# EAGLE design MAPE-CUN-Large-016 (EAGLE 7.3.0)
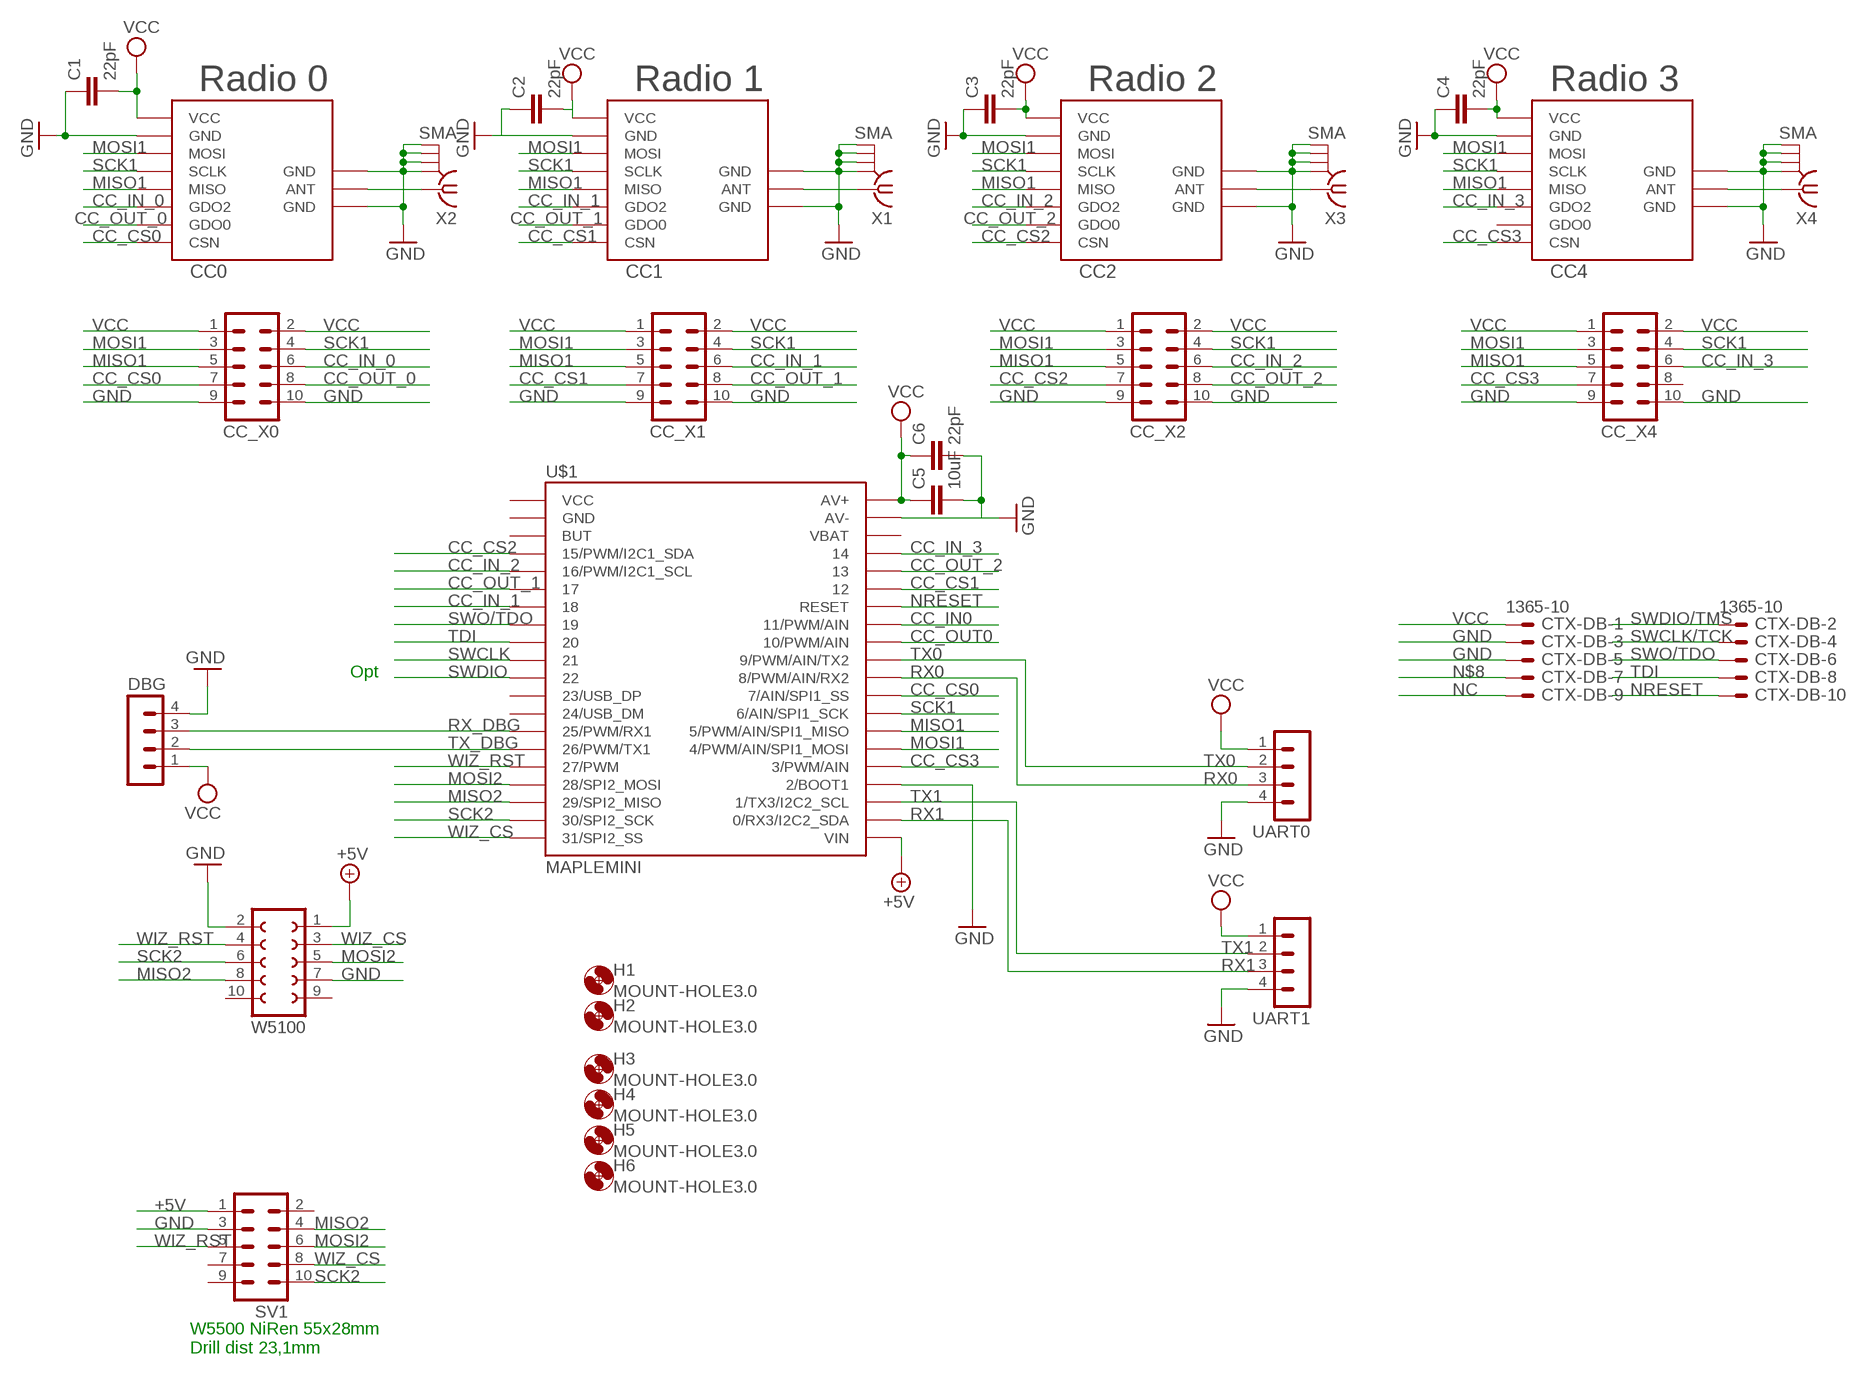
[diagram p0: schematic, sheet 1]

## Parts
C1  22pF  C-EUC0805  [C0805]
C2  22pF  C-EUC0805  [C0805]
C3  22pF  C-EUC0805  [C0805]
C4  22pF  C-EUC0805  [C0805]
C5  10uF  C-EUC1210  [C1210]
C6  22pF  C-EUC0805  [C0805]
CC0  CC1101_MODULE1SMD  [CC1101_MODULE1_SMD]
CC1  CC1101_MODULE1SMD  [CC1101_MODULE1_SMD]
CC2  CC1101_MODULE1SMD  [CC1101_MODULE1_SMD]
CC4  CC1101_MODULE1SMD  [CC1101_MODULE1_SMD]
CC_X0  MA05-2  [MA05-2]
CC_X1  MA05-2  [MA05-2]
CC_X2  MA05-2  [MA05-2]
CC_X4  MA05-2  [MA05-2]
CTX-DB  1365-10  [1365-10]
DBG  MA04-1  [MA04-1]
H1  MOUNT-HOLE3.0  [3,0]
H2  MOUNT-HOLE3.0  [3,0]
H3  MOUNT-HOLE3.0  [3,0]
H4  MOUNT-HOLE3.0  [3,0]
H5  MOUNT-HOLE3.0  [3,0]
H6  MOUNT-HOLE3.0  [3,0]
SV1  MA05-2  [MA05-2]
U$1  MAPLEMINI  [20-DIP]
UART0  MA04-1  [MA04-1]
UART1  MA04-1  [MA04-1]
W5100  FE05-2  [FE05-2]
X1  SMA  [SMA]
X2  SMA  [SMA]
X3  SMA  [SMA]
X4  SMA  [SMA]

## Nets
+5V: SV1.1 U$1.21(VIN) W5100.1
CC_CS0: CC0.CSN CC_X0.7 U$1.29(7/AIN/SPI1_SS)
CC_CS1: CC1.CSN CC_X1.7 U$1.35
CC_CS2: CC2.CSN CC_X2.7 U$1.4(15/PWM/I2C1_SDA)
CC_CS3: CC4.CSN CC_X4.7 U$1.25(3/PWM/AIN)
CC_IN0: U$1.33(11/PWM/AIN)
CC_IN_0: CC0.GDO2 CC_X0.6
CC_IN_1: CC1.GDO2 CC_X1.6 U$1.7
CC_IN_2: CC2.GDO2 CC_X2.6 U$1.5(16/PWM/I2C1_SCL)
CC_IN_3: CC4.GDO2 CC_X4.6 U$1.37
CC_OUT0: U$1.32(10/PWM/AIN)
CC_OUT_0: CC0.GDO0 CC_X0.8
CC_OUT_1: CC1.GDO0 CC_X1.8 U$1.6
CC_OUT_2: CC2.GDO0 CC_X2.8 U$1.36
GND: C1.1 C2.1 C3.1 C4.1 C5.2 C6.2 CC0.GND@0(GND) CC0.GND@1(GND) CC0.GND@2(GND) CC1.GND@0(GND) CC1.GND@1(GND) CC1.GND@2(GND) CC2.GND@0(GND) CC2.GND@1(GND) CC2.GND@2(GND) CC4.GND@0(GND) CC4.GND@1(GND) CC4.GND@2(GND) CC_X0.9 CC_X0.10 CC_X1.9 CC_X1.10 CC_X2.9 CC_X2.10 CC_X4.9 CC_X4.10 CTX-DB.3 CTX-DB.5 DBG.4 SV1.3 U$1.24(2/BOOT1) U$1.39(AV-) UART0.4 UART1.4 W5100.2 W5100.7 X1.GND@1 X1.GND@2 X1.GND@3 X1.GND@4 X2.GND@1 X2.GND@2 X2.GND@3 X2.GND@4 X3.GND@1 X3.GND@2 X3.GND@3 X3.GND@4 X4.GND@1 X4.GND@2 X4.GND@3 X4.GND@4
MISO1: CC0.MISO CC1.MISO CC2.MISO CC4.MISO CC_X0.5 CC_X1.5 CC_X2.5 CC_X4.5 U$1.27(5/PWM/AIN/SPI1_MISO)
MISO2: SV1.4 U$1.18(29/SPI2_MISO) W5100.8
MOSI1: CC0.MOSI CC1.MOSI CC2.MOSI CC4.MOSI CC_X0.3 CC_X1.3 CC_X2.3 CC_X4.3 U$1.26(4/PWM/AIN/SPI1_MOSI)
MOSI2: SV1.6 U$1.17(28/SPI2_MOSI) W5100.5
N$1: CC2.ANT X3.1
N$2: CC4.ANT X4.1
N$3: CC1.ANT X1.1
N$4: CC0.ANT X2.1
N$8: CTX-DB.7
NC: CTX-DB.9
NRESET: CTX-DB.10 U$1.34(RESET)
RX0: U$1.30(8/PWM/AIN/RX2) UART0.3
RX1: U$1.22(0/RX3/I2C2_SDA) UART1.3
RX_DBG: DBG.3 U$1.14(25/PWM/RX1)
SCK1: CC0.SCLK CC1.SCLK CC2.SCLK CC4.SCLK CC_X0.4 CC_X1.4 CC_X2.4 CC_X4.4 U$1.28(6/AIN/SPI1_SCK)
SCK2: SV1.10 U$1.19(30/SPI2_SCK) W5100.6
SWCLK: U$1.10
SWCLK/TCK: CTX-DB.4
SWDIO: U$1.11
SWDIO/TMS: CTX-DB.2
SWO/TDO: CTX-DB.6 U$1.8
TDI: CTX-DB.8 U$1.9
TX0: U$1.31(9/PWM/AIN/TX2) UART0.2
TX1: U$1.23(1/TX3/I2C2_SCL) UART1.2
TX_DBG: DBG.2 U$1.15(26/PWM/TX1)
VCC: C1.2 C2.2 C3.2 C4.2 C5.1 C6.1 CC0.VCC CC1.VCC CC2.VCC CC4.VCC CC_X0.1 CC_X0.2 CC_X1.1 CC_X1.2 CC_X2.1 CC_X2.2 CC_X4.1 CC_X4.2 CTX-DB.1 DBG.1 U$1.40(AV+) UART0.1 UART1.1
WIZ_CS: SV1.8 U$1.20(31/SPI2_SS) W5100.3
WIZ_RST: SV1.5 U$1.16(27/PWM) W5100.4
Unconnected: CC4.GDO0 CC_X4.8 SV1.2 SV1.7 SV1.9 U$1.1(VCC) U$1.2(GND) U$1.3(BUT) U$1.12(23/USB_DP) U$1.13(24/USB_DM) U$1.38(VBAT) W5100.9 W5100.10

## Notes on the sheet
- Radio 0 | Radio 1 | Radio 2 | Radio 3
- Opt
- W5500 NiRen 55x28mm
  Drill dist 23,1mm

## Library data of the parts
C1-C6 = rcl:C-EU: CAPACITOR, European symbol
CC0 CC1 CC2 CC4 = wireless:CC1101_MODULE1: CC1101 wireless module for 433/868 MHz (sold from Aliexpress). DIL version for mounting with pin header (and SMD soldering) and SMD only variant available.
CC_X0 CC_X1 CC_X2 CC_X4 SV1 = con-lstb:MA05-2: PIN HEADER; OC_FARNELL: unknown; OC_NEWARK: unknown
CTX-DB = con-leotronics:1365-10: DUAL ROW STRAIGHT HEADER 1364 SERIES. 1.27mm x 1.27mm. Without Fixing Post. SMT Source: http://www.leotronics.co.uk/Conexcon/Data%20Sheets/sec.%20A/1364ing.pdf; OC_FARNELL: unknown; OC_NEWARK: unknown
DBG UART0 UART1 = con-lstb:MA04-1: PIN HEADER; OC_FARNELL: unknown; OC_NEWARK: unknown
H1-H6 = holes:MOUNT-HOLE: MOUNTING HOLE with drill center marker
U$1 = maplemini-small:MAPLEMINI
W5100 = con-lsta:FE05-2: FEMALE HEADER; OC_FARNELL: unknown; OC_NEWARK: unknown
X1-X4 = sma:SMA: SMA 50 Ohm end launch jack receptacle - round contact

## Net classes
0 default: width 0.406 mm
1 PWR: width 0.305 mm

## Board
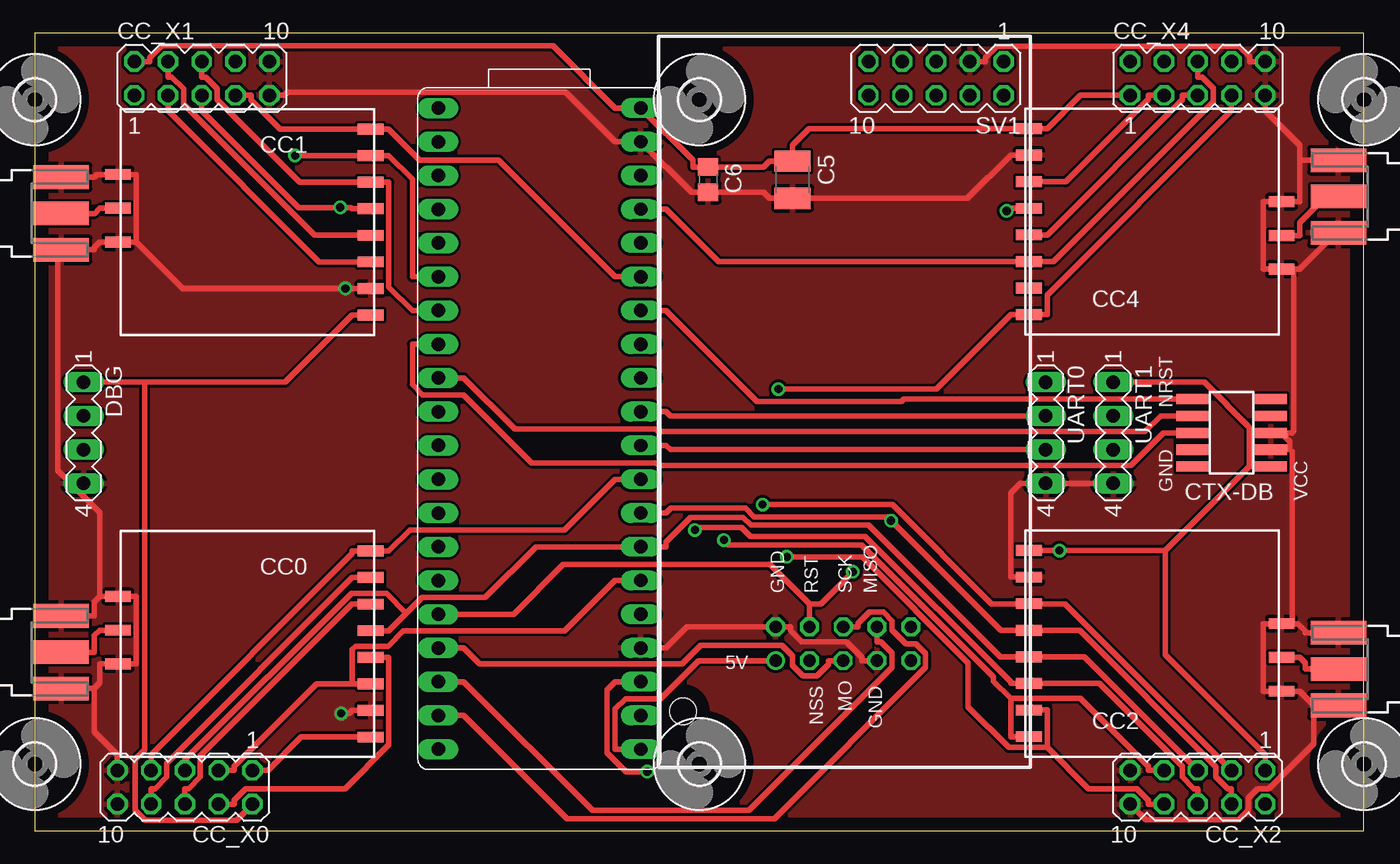
[diagram p1: board, top side]
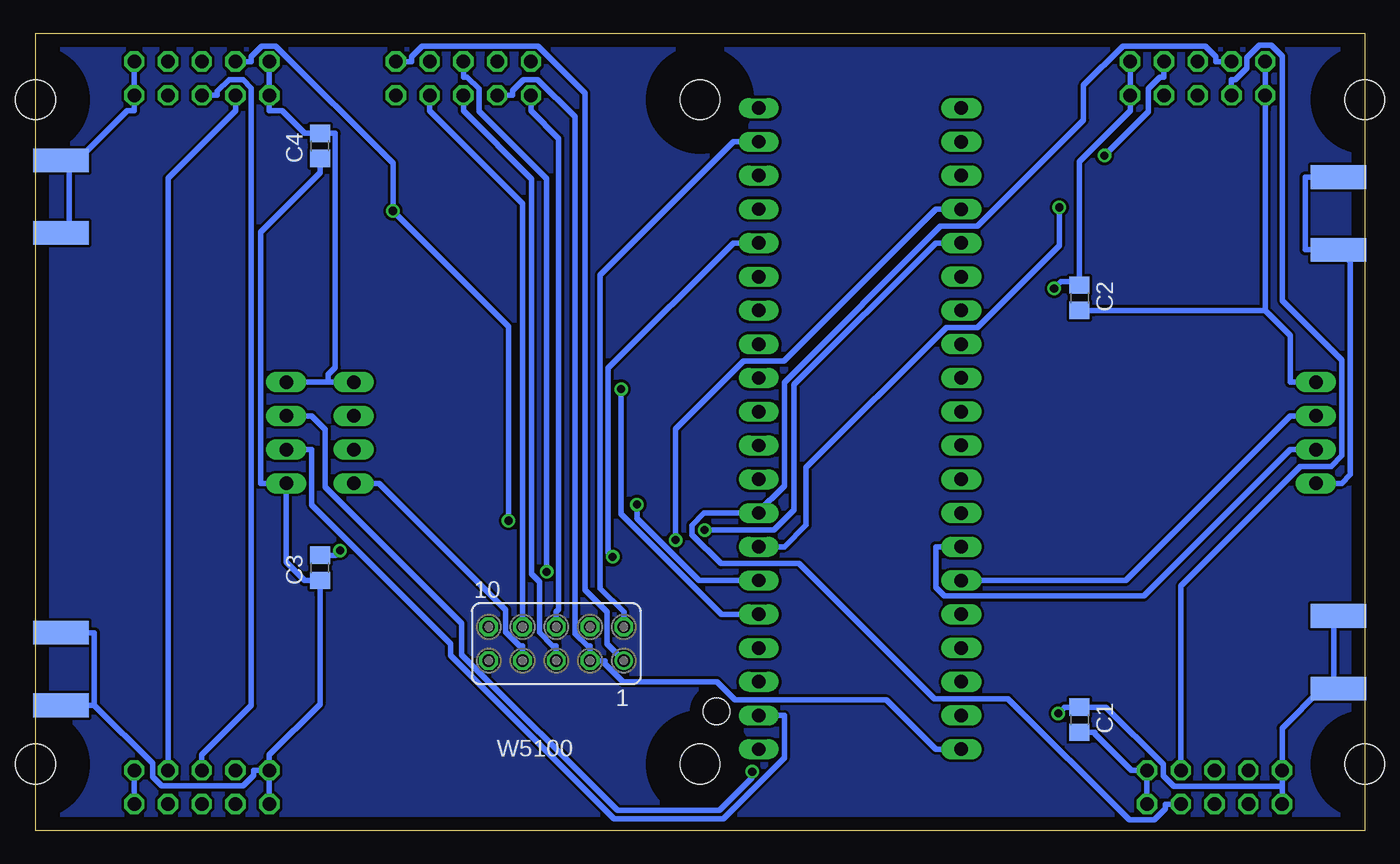
[diagram p2: board, bottom side, seen from below]

Size 100 x 60 mm. Coordinates in mm from the lower left corner, seen from the top.
Outline: 0,60 0,0 100,0 100,60 0,60
Copper layers (1*16): Top 0.035mm / dielectric 1.5mm / Bottom 0.035mm
Design rules "default": minimum track width 10mil, minimum drill 24mil, track to track 8mil, track to pad 8mil, pad to pad 8mil, via to via 8mil, smd to smd 8mil, copper to edge 40mil, drill to drill 8mil, minimum pad ring 10mil, minimum via ring 8mil, stop-mask expansion 4mil, vias tented up to drill 0mil, thermal gap 10mil
Holes 2 mm at 48.76,8.97

### Footprints (pad centres in the part's own frame; a part is rotated, then mirrored left to right if it is on the bottom)
C0805 = smd 1.3 x 1.5: 1 -0.95,0; 2 0.95,0
C1210 = smd 1.6 x 2.7: 1 -1.4,0; 2 1.4,0
CC1101_MODULE1_SMD = smd 1.93 x 0.813: ANT 19,5.96; CSN 0,0; GDO0 0,2; GDO2 0,4; GND@0 0,12; GND@1 19,8.5; GND@2 19,3.42; MISO 0,6; MOSI 0,10; SCLK 0,8; VCC 0,14
MA05-2 = drill 1.016 octagon: 1 -5.08,-1.27; 2 -5.08,1.27; 3 -2.54,-1.27; 4 -2.54,1.27; 5 0,-1.27; 6 0,1.27; 7 2.54,-1.27; 8 2.54,1.27; 9 5.08,-1.27; 10 5.08,1.27
1365-10 = smd 0.76 x 2.4: 1 -2.54,-2.95; 2 -2.54,2.95; 3 -1.27,-2.95; 4 -1.27,2.95; 5 0,-2.95; 6 0,2.95; 7 1.27,-2.95; 8 1.27,2.95; 9 2.54,-2.95; 10 2.54,2.95
MA04-1 = drill 1.016 long: 1 -3.81,0; 2 -1.27,0; 3 1.27,0; 4 3.81,0
3,0 = hole 3: 0,0
20-DIP = drill 1.016 pad 1.27 long: 1 -24.13,-7.62; 2 -21.59,-7.62; 3 -19.05,-7.62; 4 -16.51,-7.62; 5 -13.97,-7.62; 6 -11.43,-7.62; 7 -8.89,-7.62; 8 -6.35,-7.62; 9 -3.81,-7.62; 10 -1.27,-7.62; 11 1.27,-7.62; 12 3.81,-7.62; 13 6.35,-7.62; 14 8.89,-7.62; 15 11.43,-7.62; 16 13.97,-7.62; 17 16.51,-7.62; 18 19.05,-7.62; 19 21.59,-7.62; 20 24.13,-7.62 | drill 1 pad 1.27 long: 21 24.13,7.62; 22 21.59,7.62; 23 19.05,7.62; 24 16.51,7.62; 25 13.97,7.62; 26 11.43,7.62; 27 8.89,7.62; 28 6.35,7.62; 29 3.81,7.62; 30 1.27,7.62; 31 -1.27,7.62; 32 -3.81,7.62; 33 -6.35,7.62; 34 -8.89,7.62; 35 -11.43,7.62; 36 -13.97,7.62; 37 -16.51,7.62; 38 -19.05,7.62; 39 -21.59,7.62; 40 -24.13,7.62
FE05-2 = drill 0.914: 1 -5.08,1.27 | drill 0.914 octagon: 2 -5.08,-1.27; 3 -2.54,1.27; 4 -2.54,-1.27; 5 0,1.27; 6 0,-1.27; 7 2.54,1.27; 8 2.54,-1.27; 9 5.08,1.27; 10 5.08,-1.27
SMA = smd 4.191 x 1.778: 1 2.115,0; GND@1 2.115,2.733; GND@2 2.115,-2.733 | smd 4.191 x 1.778 bottom: GND@3 2.115,2.733; GND@4 2.115,-2.733

### Placement (x,y rotation side)
C1  21.45,8.34 270 bottom
C2  21.45,40.09 270 bottom
C3  78.6,19.77 90 bottom
C4  78.6,51.52 90 bottom
C5  57.01,48.98 270 top
C6  50.66,48.98 270 top
CC0  25.26,21.04 180 top
CC1  25.26,52.79 180 top
CC2  74.79,7.07 0 top
CC4  74.79,38.82 0 top
CC_X0  11.29,3.26 180 top
CC_X1  12.56,56.6 0 top
CC_X2  87.49,3.26 180 top
CC_X4  87.49,56.6 0 top
CTX-DB  90.03,29.93 90 top
DBG  3.67,29.93 270 top
H1  100,5 0 top
H2  100,55 90 top
H3  0,5 0 top
H4  0,55 0 top
H5  50,5 0 top
H6  50,55 0 top
SV1  67.8,56.6 180 top
U$1  37.96,30.25 270 top
UART0  76.06,29.93 270 top
UART1  81.14,29.93 270 top
W5100  60.82,14.05 180 bottom
X1  -0.14,46.44 0 top
X2  -0.14,13.42 0 top
X3  100.19,12.15 180 top
X4  100.19,47.71 180 top

### Tracks (layer width: path | path; a pad name or v marks a point on that pad's centre or on a via)
+5V
  Top 0.406: U$1.21 43.67,6.12 43.67,9.15 44.45,9.93 47.08,9.93 49.94,12.79 W5100.1
  Bottom 0.406: SV1.1 71.72,57.87 71.72,58.23 70.91,59.04 62.2,59.04 58.66,55.5 58.66,18.09 57.01,16.44 57.01,14.05 W5100.1
CC_CS0
  Top 0.406: CC_X0.7 8.75,5.7 23.89,20.84 23.89,21.04 CC0.CSN 26.63,21.04 28.22,22.63 39.85,22.63 43.67,26.44 U$1.29
CC_CS1
  Top 0.406: U$1.35 43.67,41.68 34.88,50.47 28.96,50.47 26.63,52.79 CC1.CSN 23.89,52.79 18.45,52.79 16.27,54.97 16.27,55.33 CC_X1.7
CC_CS2  (via drill 0.61 pad 1.02)
  Top 0.406: 73.42,9.94 72.13,11.23 72.13,11.58 62.2,21.51 52.2,21.51 v51.84,21.87 | 73.42,9.94 73.42,7.07 CC2.CSN | 73.42,9.94 78.66,9.94 83.78,4.82 83.78,4.53 CC_X2.7
  Bottom 0.406: U$1.4 32.27,46.76 43.7,35.33 46.73,35.33 51.84,30.22 v51.84,21.87
CC_CS3  (via drill 0.61 pad 1.02)
  Top 0.406: CC_X4.7 90.03,54.16 76.16,40.29 76.16,38.82 CC4.CSN 74.1,38.82 73.42,38.82 67.81,33.21 v55.95,33.21
  Bottom 0.406: v55.95,33.21 55.95,23.82 48.4,16.28 47.49,16.28 U$1.25
CC_IN_0
  Top 0.406: CC0.GDO2 23.89,17.04 12.46,5.61 12.46,4.04 11.58,3.16 11.29,3.16 CC_X0.6
CC_IN_1
  Top 0.406: CC_X1.6 12.56,56.7 12.85,56.7 13.73,55.83 13.73,55 19.94,48.79 CC1.GDO2 26.63,48.79 26.63,40.92 28.41,39.14 U$1.7
CC_IN_2  (via drill 0.61 pad 1.02)
  Top 0.406: v49.66,22.61 49.88,22.83 53.16,22.83 53.86,22.13 62.46,22.13 73.42,11.17 73.42,11.07 CC2.GDO2 80.09,11.07 86.32,4.83 86.32,4.04 87.2,3.16 87.49,3.16 CC_X2.6
  Bottom 0.406: U$1.5 32.27,44.22 42.94,33.55 42.94,24.12 44.45,22.61 v49.66,22.61
CC_IN_3
  Top 0.406: U$1.37 47.49,46.76 51.43,42.82 CC4.GDO2 76.63,42.82 88.68,54.87 88.68,55.87 87.85,56.7 87.49,56.7 CC_X4.6
CC_OUT_0
  Top 0.406: CC0.GDO0 23.89,19.04 9.92,5.07 9.92,4.04 9.04,3.16 8.75,3.16 CC_X0.8
CC_OUT_1  (via drill 0.61 pad 1.02)
  Top 0.406: U$1.6 28.41,41.68 28.41,49.01 26.63,50.79 CC1.GDO0 v19.58,50.79
  Bottom 0.406: CC_X1.8 15.1,56.7 15.39,56.7 16.27,55.83 16.27,54.1 v19.58,50.79
CC_OUT_2  (via drill 0.61 pad 1.02)
  Top 0.406: v56.58,20.59 62.26,20.59 70.22,12.63 70.22,9.32 73.28,6.26 76.16,6.26 | 76.16,6.26 76.16,9.07 CC2.GDO0 | 76.16,6.26 79.26,3.16 82.91,3.16 83.78,2.28 83.78,1.99 CC_X2.8
  Bottom 0.406: U$1.36 47.49,44.22 56.91,34.8 56.91,20.93 v56.58,20.59
GND  (via drill 0.61 pad 1.02)
  Top 0.406: 93.78,29.93 94.43,29.28 94.43,28.66 | 94.59,15.57 95.01,15.57 95.57,15.01 95.57,14.88 X3.GND@4 | 94.59,15.57 CC2.GND@1 92.42,15.57 92.42,10.49 93.61,10.49 CC2.GND@2 95.16,10.49 95.16,10.47 96.21,9.42 | 94.43,28.66 94.59,28.51 94.59,15.57 | CTX-DB.3 94.43,28.66 | 93.78,29.93 94.59,29.93 94.72,30.06 94.72,42.24 | CTX-DB.5 93.78,29.93 | 94.72,42.24 95.16,42.24 97.9,44.98 X4.GND@3 | 94.72,42.24 94.26,42.24 CC4.GND@2 92.42,42.24 92.42,47.32 CC4.GND@1 95.16,47.32 95.16,50.44 | CC_X4.9 92.57,54.16 95.16,51.57 95.16,50.44 | 95.16,50.44 95.57,50.44 X4.GND@4 | UART1.4 UART0.4 74.13,26.12 73.42,25.41 73.42,19.07 CC2.GND@0 | 4.89,17.62 4.48,17.21 4.48,16.15 X2.GND@3 | 2.71,26.12 4.89,23.94 4.89,17.62 | CC0.GND@0 23.89,9.04 23.66,8.81 v23.05,8.81 | 96.21,9.42 96.21,6.52 92.86,3.16 92.01,3.16 91.3,2.45 91.3,1.53 90.56,0.8 83.6,0.8 CC_X2.10 | 2.14,43.71 4.48,43.71 4.48,43.88 4.89,44.29 CC1.GND@1 7.63,44.29 | X1.GND@4 2.14,43.71 | 2.71,26.12 1.73,27.09 1.73,43.3 2.14,43.71 | 7.63,44.29 11.13,40.79 v23.36,40.79 23.89,40.79 CC1.GND@0 | DBG.4 2.71,26.12 | CC_X1.9 18.81,55.33 19.04,55.56 39.94,55.56 43.67,51.84 U$1.39 49.39,48.03 C6.2 54.8,48.03 55.25,47.58 C5.2 70.18,47.58 73.42,50.82 CC4.GND@0 | 7.63,44.29 7.63,49.37 CC1.GND@2 4.68,49.37 4.48,49.17 X1.GND@3 | 4.48,10.69 4.89,11.1 4.89,12.54 5.73,12.54 CC0.GND@1 7.63,12.54 7.63,17.62 CC0.GND@2 4.89,17.62 | 4.48,10.69 4.33,10.69 X2.GND@4 | CC_X0.9 6.21,5.7 4.48,7.43 4.48,10.69 | W5100.7 62.24,12.79 62.24,13.02 61.05,14.21 57.7,14.21 56.86,15.04 56.86,15.32 W5100.2 49.08,15.32 47.49,13.74 U$1.24 | CC_X4.10 91.4,57.87 91.4,58.23 90.59,59.04 72.39,59.04 71.51,58.16 71.51,57.87 SV1.3
  Top 0.406: X3.GND@3 96.21,9.42
  Bottom 0.406: C4.1 78.6,49.51 83.07,45.04 83.07,26.12 UART1.4 81.14,20.2 79.76,18.82 C3.1 78.6,17.76 78.6,9.51 82.41,5.7 CC_X2.9 | DBG.4 1.74,26.12 1.08,26.78 1.08,42.81 X1.GND@4 4.48,43.71 4.48,49.17 X1.GND@3 | CC_X2.9 83.58,4.53 83.58,4.17 84.39,3.36 90.52,3.36 91.2,4.04 91.2,5.04 95.57,9.42 | 95.57,9.42 96.82,9.42 X3.GND@3 | X3.GND@4 95.57,14.88 95.57,9.42 | CC_X2.10 CC_X2.9 | v23.05,8.81 22.61,9.25 22.61,9.29 C1.1 19.47,9.29 15.15,4.98 15.15,4.13 14.34,3.31 6.21,3.31 | W5100.7 63.36,13.9 63.59,13.9 64.63,14.94 64.63,16.62 74.13,26.12 UART0.4 | W5100.2 55.74,16.44 57.52,18.22 57.52,41.81 47.49,51.84 U$1.39 | 97.45,50.44 96.82,50.44 93.11,54.16 92.57,54.16 CC_X4.9 CC_X4.10 | X4.GND@4 97.45,50.44 | X4.GND@3 97.45,44.98 97.45,50.44 | 21.45,41.3 22.85,41.3 v23.36,40.79 | 21.45,41.3 21.45,41.57 21.45,50.35 17.64,54.16 CC_X1.9 CC_X1.10 | C2.1 21.45,41.3 | 6.21,3.31 CC_X0.10 | 6.21,3.31 CC_X0.9 6.21,7.7 3.23,10.69 2.34,10.69 | X2.GND@4 2.34,10.69 | X2.GND@3 2.34,16.15 2.34,10.69
  pour Top: -0.14,59.78 -0.14,0.08 100.19,0.08 100.19,59.78
MISO1  (via drill 0.61 pad 1.02)
  Top 0.406: CC_X1.5 12.56,54.16 19.83,46.89 v22.97,46.89 23.79,46.89 23.89,46.79 CC1.MISO | CC4.MISO 76.16,44.82 86.32,54.98 86.32,55.33 CC_X4.5 | 27.95,16.36 26.63,15.04 CC0.MISO | 27.95,16.36 29.14,17.55 33.89,17.55 37.7,21.36 U$1.27 47.49,21.36 47.49,21.73 49.33,23.57 53.28,23.57 53.87,22.98 62.73,22.98 72.64,13.07 73.42,13.07 CC2.MISO 78.95,13.07 CC_X2.5 | CC_X0.5 11.29,5.32 23.83,17.85 26.45,17.85 27.95,16.36
  Bottom 0.406: v22.97,46.89 22.97,44.03 29.13,37.87 31.48,37.87 42.03,27.32 42.03,22.99 43.67,21.36 U$1.27 | CC_X2.5 87.49,5.7 83.77,9.42 83.77,55.88 84.39,56.5 85.44,56.5 86.32,55.62 86.32,55.33 CC_X4.5
MISO2
  Top 0.406: U$1.18 32.27,11.2 41.95,1.51 53.73,1.51 64.49,12.28 64.49,13.35 63.64,14.21 63.36,14.21 W5100.8
  Bottom 0.406: SV1.4 70.34,54.16 63.36,47.18 63.36,16.44 W5100.8
MOSI1  (via drill 0.61 pad 1.02)
  Top 0.406: v54.75,24.53 64.52,24.53 71.98,17.07 CC2.MOSI 77.49,17.07 CC_X2.3 | CC_X0.3 15,4.53 15,4.82 21.22,11.04 23.89,11.04 | CC0.MOSI 23.89,11.04 | U$1.26 43.67,18.82 39.85,15.01 27.72,15.01 26.56,13.85 24.12,13.85 23.89,13.62 23.89,11.04 | CC1.MOSI 21.39,42.79 10.02,54.16 CC_X1.3 | CC_X4.3 83.78,55.33 83.78,55.04 77.56,48.82 CC4.MOSI
  Bottom 0.406: CC_X4.3 84.95,54.16 90.03,49.08 90.03,5.7 CC_X2.3 | v54.75,24.53 54.75,23.48 50.08,18.82 47.49,18.82 U$1.26 | CC_X0.3 13.83,18.39 4.83,27.39 2.52,27.39 1.71,28.21 1.71,35.4 6.19,39.89 6.19,58.27 7.01,59.08 7.93,59.08 8.85,58.16 8.85,57.38 9.73,56.5 10.02,56.5 CC_X1.3
MOSI2
  Top 0.406: U$1.17 32.27,13.74 33.46,12.55 48.7,12.55 50.09,13.94 56.2,13.94 57.01,13.13 57.01,12.44 57.81,11.64 58.84,11.64 59.7,12.51 59.7,12.79 W5100.5
  Bottom 0.406: SV1.6 67.8,54.16 62.67,49.03 62.67,19.31 62.09,18.73 62.09,14.9 61.1,13.9 60.82,13.9 W5100.5
N$1
  Top 0.406: X3.1 95.57,12.15 95.57,12.62 95.16,13.03 CC2.ANT
N$2
  Top 0.406: CC4.ANT 95.16,44.78 95.16,45.73 97.14,47.71 X4.1
N$3
  Top 0.406: CC1.ANT 4.89,46.83 4.5,46.44 X1.1
N$4
  Top 0.406: X2.1 4.48,13.42 4.48,14.67 4.89,15.08 CC0.ANT
N$5
  pour Bottom: -0.14,59.78 -0.14,0.08 100.19,0.08 100.19,59.78
NRESET
  Top 0.406: U$1.34 47.49,39.14 54.35,32.28 65.21,32.28 65.4,32.47 CTX-DB.10
RX0
  Top 0.406: U$1.30 47.49,28.98 47.81,28.66 UART0.3
RX1
  Bottom 0.406: U$1.22 43.67,8.66 43.67,5.46 48.22,0.9 56.47,0.9 68.75,13.19 68.75,14.05 79.21,24.51 79.21,28.66 UART1.3
RX_DBG
  Bottom 0.406: DBG.3 5.6,28.66 16.62,17.64 31.63,17.64 32.27,18.28 32.27,21.36 U$1.14
SCK1  (via drill 0.61 pad 1.02)
  Top 0.406: v73.11,46.63 73.23,46.63 73.42,46.82 CC4.SCLK | U$1.28 47.49,23.9 47.86,24.26 53.45,24.26 54.12,23.59 64.15,23.59 v64.42,23.32 72.67,15.07 CC2.SCLK 78.61,15.07 88.86,4.81 88.86,4.04 89.74,3.16 90.03,3.16 CC_X2.4 | CC0.SCLK 26.63,13.04 26.63,6.45 23.34,3.16 15.88,3.16 15,2.28 15,1.99 CC_X0.4 | CC_X1.4 10.02,56.7 10.31,56.7 11.19,55.83 11.19,54.66 21.05,44.79 CC1.SCLK
  Bottom 0.406: v64.42,23.32 64.42,37.94 v73.11,46.63 73.11,50.23 81.92,59.04 82.97,59.04 83.78,58.23 83.78,57.87 CC_X4.4 | CC_X1.4 11.19,57.87 11.19,58.23 11.99,59.04 18.19,59.04 21.16,56.07 21.16,53.46 29.13,45.49 31.91,45.49 43.66,33.73 43.66,25.94 45.71,23.9 45.87,23.9 | 45.87,23.9 U$1.28 | 45.87,23.9 49.69,23.9 50.61,22.98 50.61,22.26 48.44,20.09 42.55,20.09 32.39,9.93 26.82,9.93 17.71,0.81 15.81,0.81 15,1.63 15,1.99 CC_X0.4
SCK2
  Top 0.406: U$1.19 32.27,8.66 40.02,0.9 55.63,0.9 67.02,12.29 67.02,13.32 66.28,14.05 65.54,14.05 64.49,15.11 64.49,15.79 63.84,16.44 62.78,16.44 61.94,15.6 61.94,15.32 W5100.6
  Bottom 0.406: W5100.6 60.82,16.44 60.63,16.63 60.63,52.07 62.73,54.16 SV1.10
SWO/TDO
  Top 0.406: U$1.8 28.41,36.6 28.41,33.55 29.17,32.79 32.27,32.79 37.39,27.67 46.74,27.67 46.95,27.46 82.44,27.46 84.91,29.93 CTX-DB.6
TDI
  Top 0.406: CTX-DB.8 84.7,31.2 83.52,30.02 46.93,30.02 46.74,30.21 36.12,30.21 32.27,34.06 U$1.9
TX0
  Top 0.406: UART0.2 74.13,31.2 47.81,31.2 47.49,31.52 U$1.31
TX1  (via drill 0.61 pad 1.02)
  Top 0.406: U$1.23 43.67,11.2 43.05,10.58 43.05,5.85 44.46,4.44 v46.08,4.44
  Bottom 0.406: UART1.2 79.21,31.2 78.21,30.2 78.21,25.85 67.93,15.57 67.93,13.22 56.21,1.51 48.55,1.51 46.08,3.98 v46.08,4.44
TX_DBG
  Bottom 0.406: U$1.15 17.98,18.82 5.6,31.2 DBG.2
VCC  (via drill 0.61 pad 1.02)
  Top 0.406: CC_X2.1 92.57,5.7 85.05,13.21 85.05,21.07 | 85.05,21.07 v77.09,21.07 76.16,21.07 CC2.VCC | 91.37,27.39 85.05,21.07 | UART1.1 87.97,33.74 91.37,30.34 91.37,27.39 | CTX-DB.1 91.37,27.39 | CC_X4.1 78.67,55.33 76.16,52.82 CC4.VCC 58.24,52.82 57.01,51.59 C5.1 55.25,50.38 54.8,49.93 C6.1 49.5,49.93 49.5,50.45 U$1.40 43.67,54.38 39,59.05 9.53,59.05 8.65,58.16 8.65,57.87 CC_X1.2 | 8.27,33.74 18.84,33.74 23.89,38.79 CC1.VCC | DBG.1 8.27,33.74 | CC_X0.2 15.17,0.79 8.29,0.79 7.54,1.54 7.54,5.35 8.27,6.08 8.27,33.74 | CC_X0.1 17.54,4.53 20.05,7.04 CC0.VCC
  Bottom 0.406: v77.09,21.07 77.44,20.72 C3.2 | UART1.1 77.99,33.74 | UART0.1 77.99,33.74 | 77.99,33.74 77.99,34.3 77.44,34.85 77.44,52.47 C4.2 79.76,52.47 81.45,54.16 82.41,54.16 CC_X4.1 CC_X4.2 | 7.48,39.14 7.48,54.16 CC_X1.1 CC_X1.2 | 7.48,39.14 5.6,37.26 5.6,33.74 DBG.1 | 7.48,39.14 20.29,39.14 C2.2 | C1.2 20.29,7.39 20.29,7.29 17.54,4.53 CC_X0.1 CC_X0.2 | CC_X2.2 CC_X2.1
WIZ_CS
  Bottom 0.406: U$1.20 32.27,6.12 35.97,9.82 47.36,9.82 48.74,11.19 55.8,11.19 57.16,12.55 57.16,12.79 W5100.3 58.28,13.9 58.48,13.9 59.4,14.82 59.4,53.7 62.22,56.52 63.27,56.52 64.1,55.69 64.1,55.33 SV1.8
WIZ_RST  (via drill 0.61 pad 1.02)
  Top 0.406: 58.28,17.06 59.13,17.06 v61.55,19.47 | U$1.16 36.01,16.28 39.74,20.01 55.32,20.01 58.28,17.06 | 58.28,17.06 58.28,16.44 W5100.4
  Bottom 0.406: v61.55,19.47 61.55,49.05 66.64,54.15 66.64,55.83 67.51,56.7 67.8,56.7 SV1.5

### Text on the board
tNames: NRST | GND | VCC | GND | RST | SCK | MISO | 5V | NSS | GND | MO